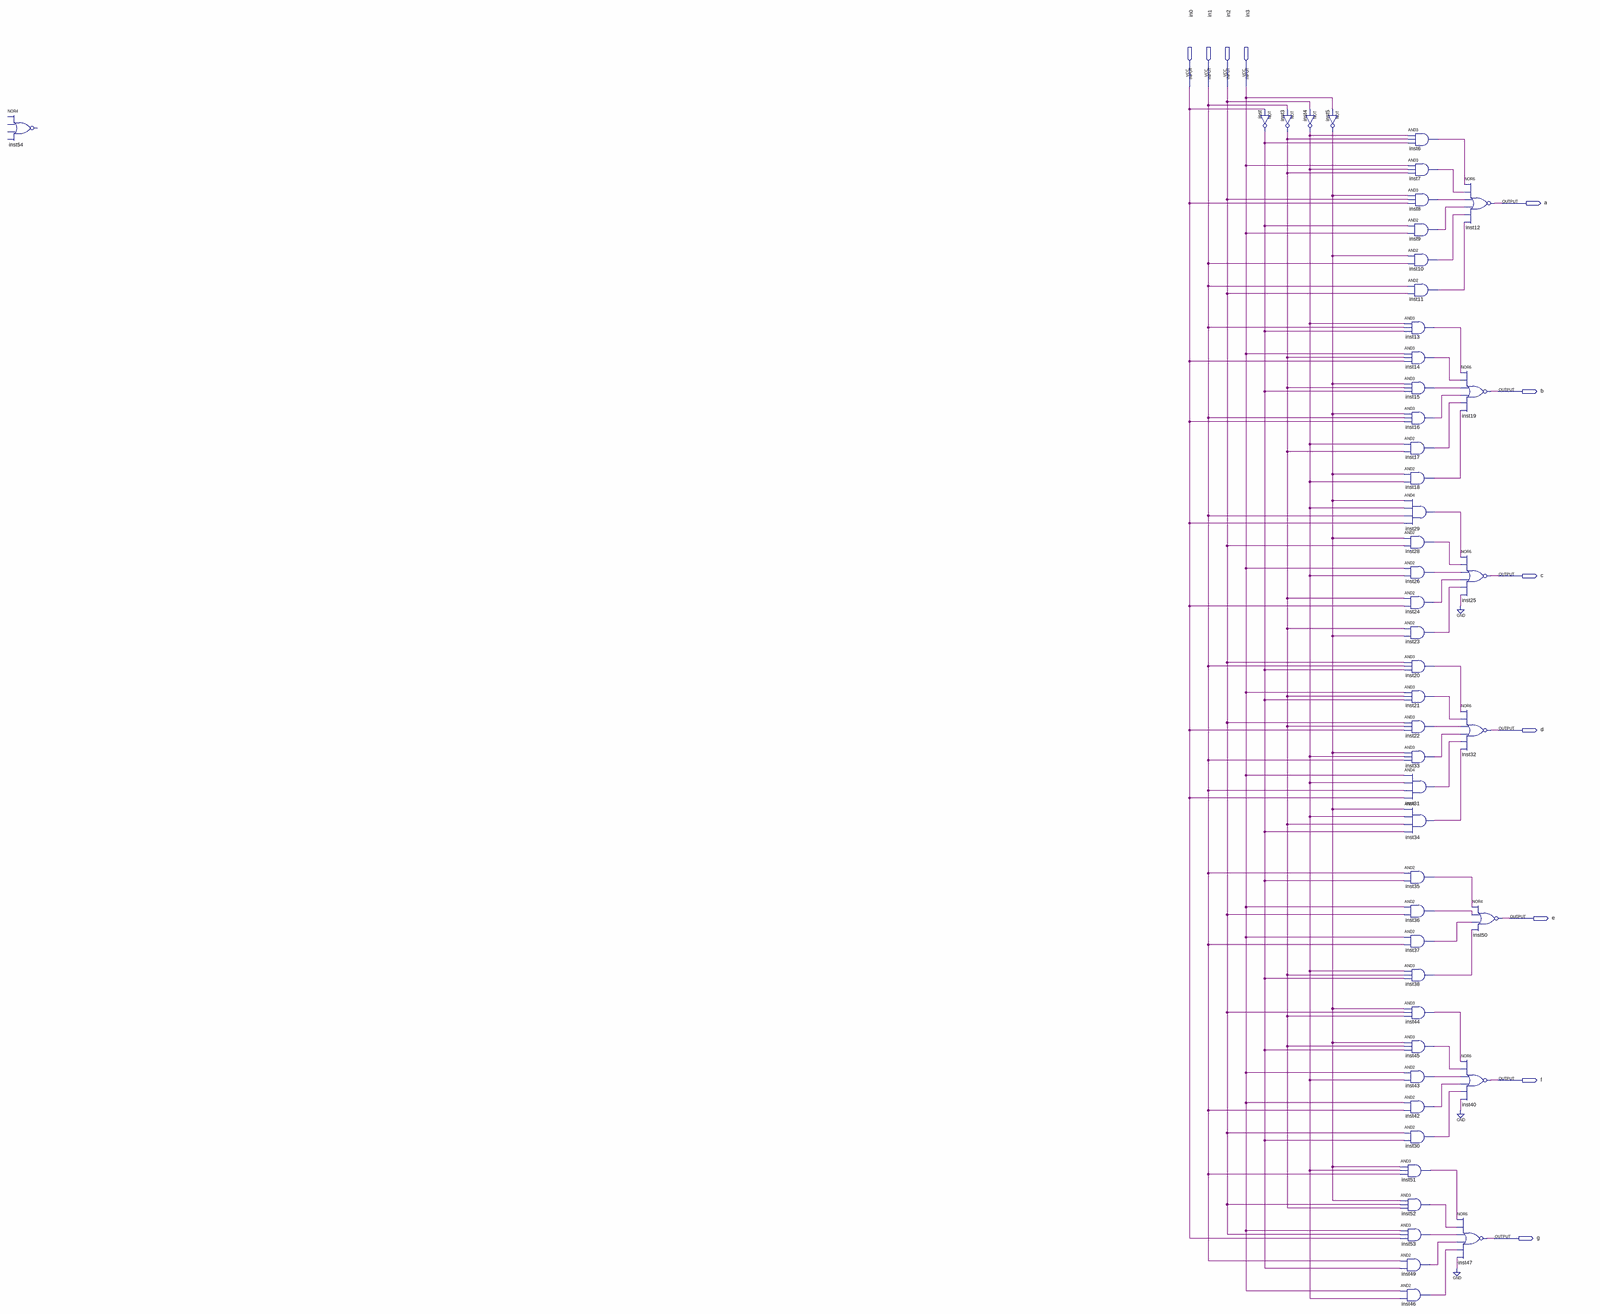
[diagram p0: schematic sheet, whole]
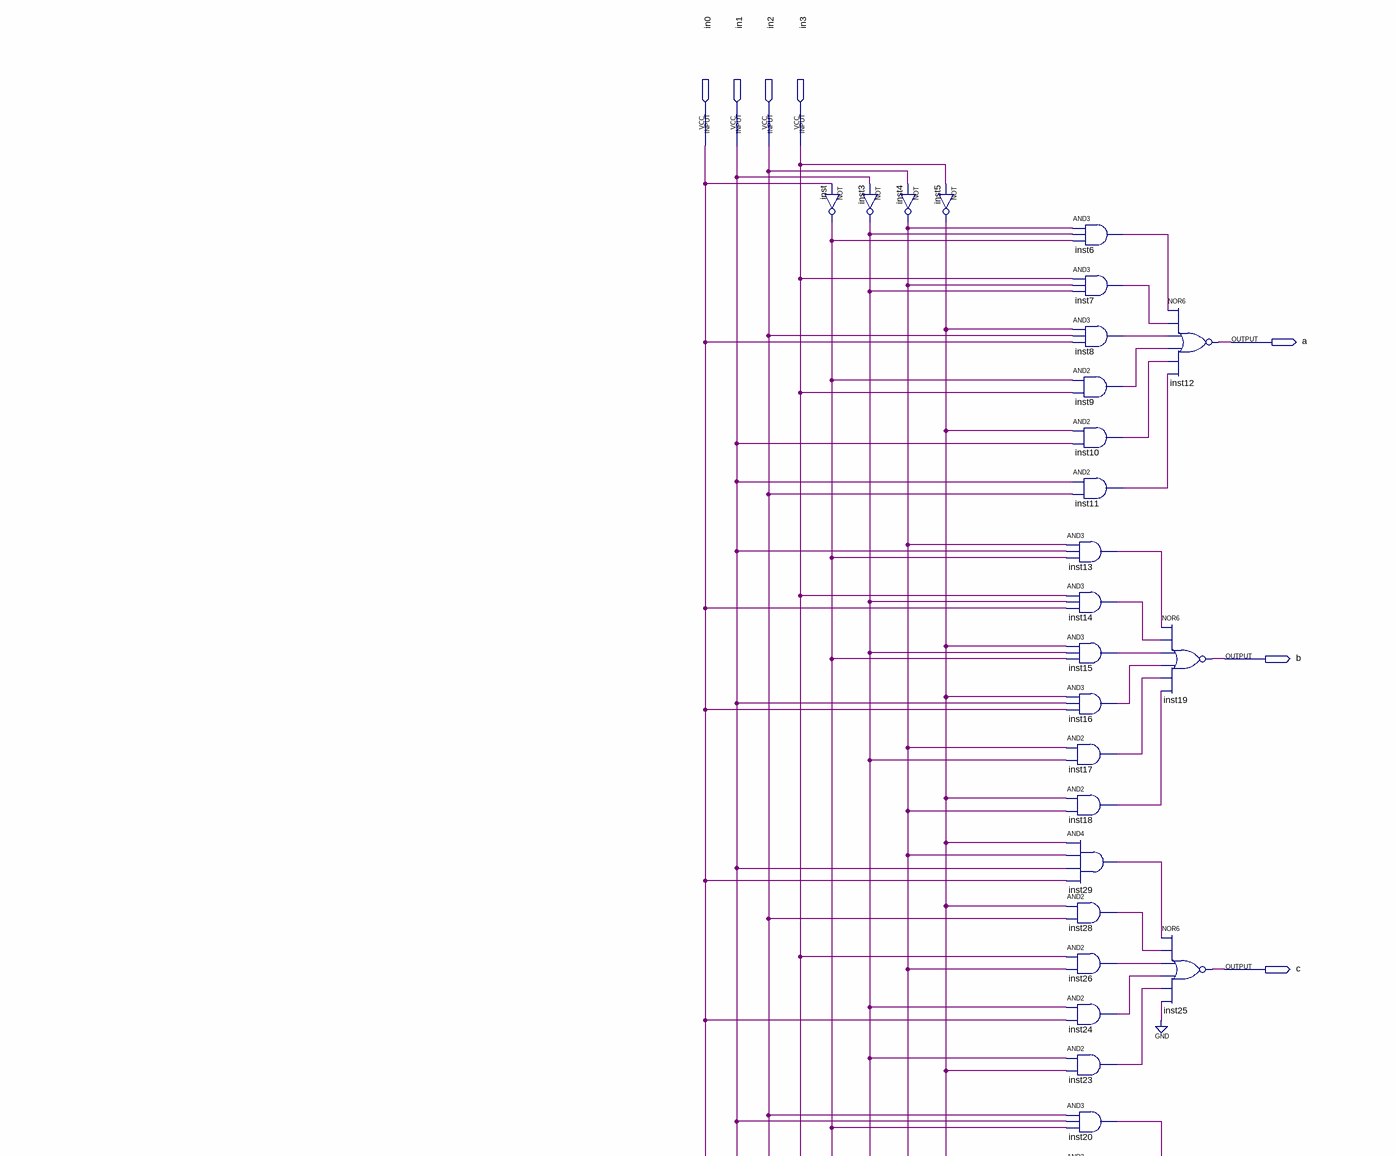
[diagram p1: schematic sheet, upper right part]
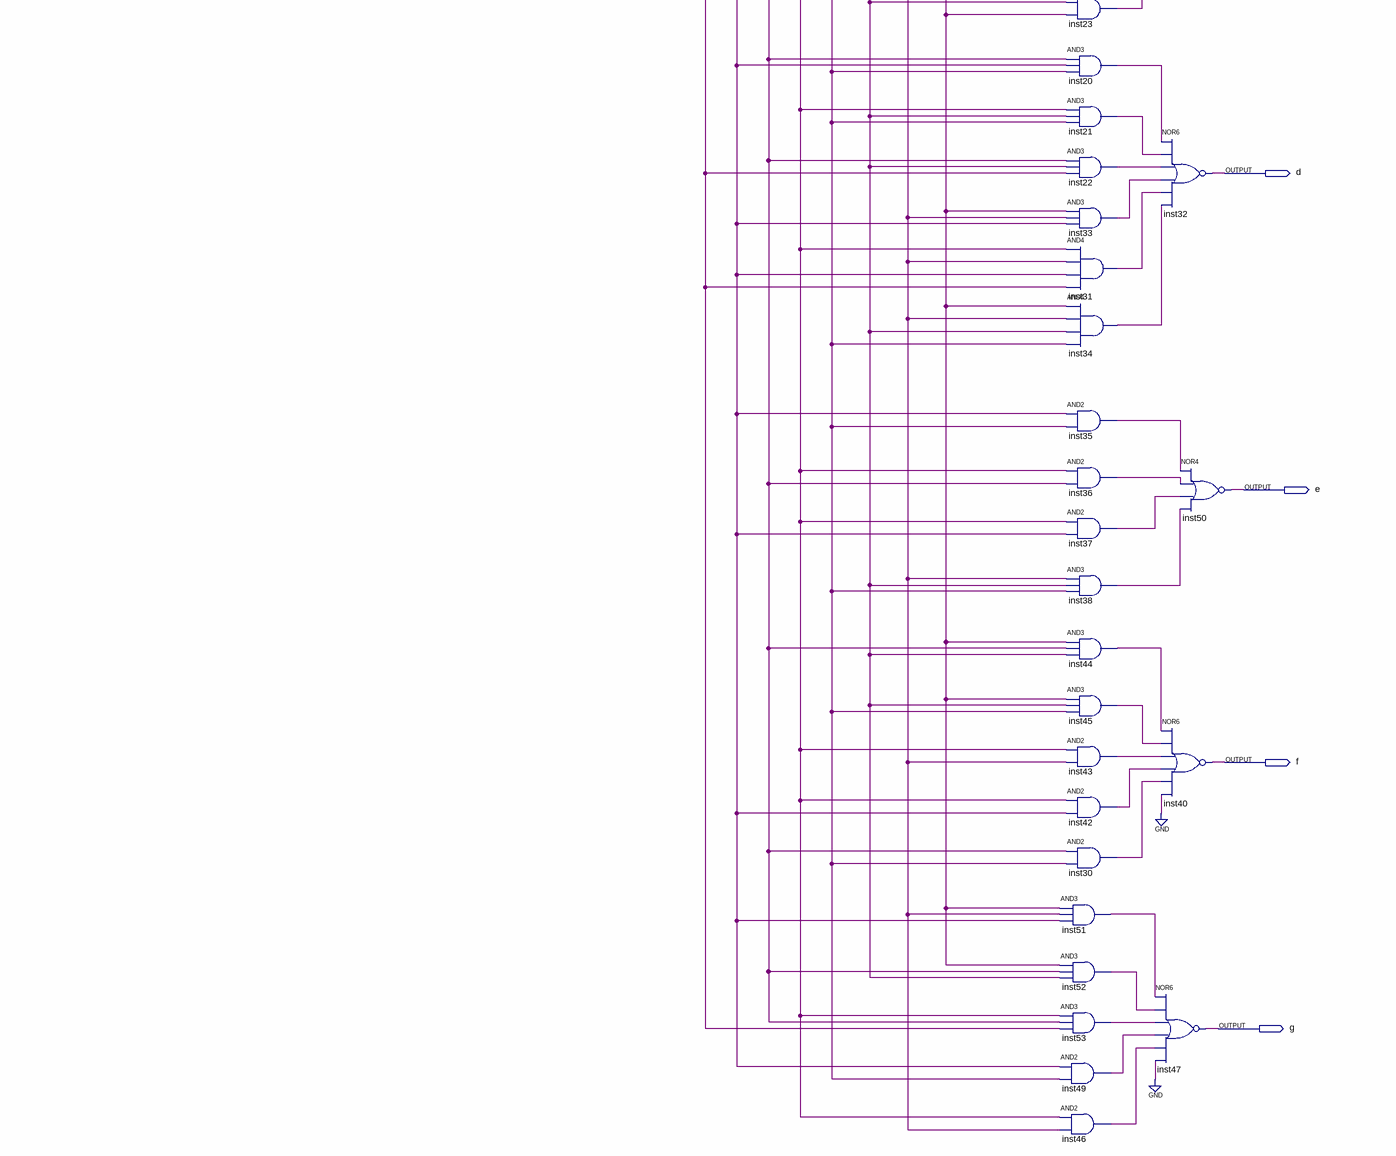
[diagram p2: schematic sheet, lower right part]
// Quartus schematic lab4.bdf as structural Verilog: 49 symbols, 11 pins
module lab4 (
  input  in0,
  input  in1,
  input  in2,
  input  in3,
  output a,
  output b,
  output c,
  output d,
  output e,
  output f,
  output g
);

  wire inst3_out, inst4_out, inst5_out, inst6_out, inst7_out, inst8_out, inst9_out, inst10_out, inst11_out,
       inst13_out, inst14_out, inst15_out, inst16_out, inst17_out, inst18_out, inst20_out, inst21_out,
       inst22_out, inst23_out, inst24_out, inst26_out, inst28_out, inst29_out, inst30_out, inst31_out,
       inst33_out, inst34_out, inst35_out, inst36_out, inst37_out, inst38_out, inst42_out, inst43_out,
       inst44_out, inst45_out, inst46_out, inst49_out, inst51_out, inst52_out, inst53_out, inst_out;

  // NOR4 inst54 is placed but not wired
  not inst (inst_out, in0);
  not inst3 (inst3_out, in1);
  not inst4 (inst4_out, in2);
  not inst5 (inst5_out, in3);
  and inst6 (inst6_out, inst4_out, inst3_out, inst_out);
  and inst7 (inst7_out, in3, inst4_out, inst3_out);
  and inst8 (inst8_out, inst5_out, in2, in0);
  and inst9 (inst9_out, inst_out, in3);
  and inst10 (inst10_out, inst5_out, in1);
  and inst11 (inst11_out, in1, in2);
  and inst13 (inst13_out, inst4_out, in1, inst_out);
  and inst14 (inst14_out, in3, inst3_out, in0);
  and inst15 (inst15_out, inst5_out, inst3_out, inst_out);
  and inst16 (inst16_out, inst5_out, in1, in0);
  and inst17 (inst17_out, inst4_out, inst3_out);
  and inst18 (inst18_out, inst5_out, inst4_out);
  and inst29 (inst29_out, inst5_out, inst4_out, in1, in0);
  and inst28 (inst28_out, inst5_out, in2);
  and inst26 (inst26_out, in3, inst4_out);
  and inst24 (inst24_out, inst3_out, in0);
  and inst23 (inst23_out, inst3_out, inst5_out);
  and inst20 (inst20_out, in2, in1, inst_out);
  and inst21 (inst21_out, in3, inst3_out, inst_out);
  and inst22 (inst22_out, in2, inst3_out, in0);
  and inst33 (inst33_out, inst5_out, inst4_out, in1);
  and inst31 (inst31_out, in3, inst4_out, in1, in0);
  and inst34 (inst34_out, inst5_out, inst4_out, inst3_out, inst_out);
  and inst35 (inst35_out, in1, inst_out);
  and inst36 (inst36_out, in3, in2);
  and inst37 (inst37_out, in3, in1);
  and inst38 (inst38_out, inst4_out, inst3_out, inst_out);
  and inst44 (inst44_out, inst5_out, in2, inst3_out);
  and inst45 (inst45_out, inst5_out, inst3_out, inst_out);
  and inst43 (inst43_out, in3, inst4_out);
  and inst42 (inst42_out, in3, in1);
  and inst30 (inst30_out, in2, inst_out);
  and inst51 (inst51_out, inst5_out, inst4_out, in1);
  and inst52 (inst52_out, inst5_out, in2, inst3_out);
  and inst53 (inst53_out, in3, in2, in0);
  and inst49 (inst49_out, in1, inst_out);
  and inst46 (inst46_out, in3, inst4_out);
  nor inst12 (a, inst6_out, inst7_out, inst8_out, inst9_out, inst10_out, inst11_out);
  nor inst19 (b, inst13_out, inst14_out, inst15_out, inst16_out, inst17_out, inst18_out);
  nor inst25 (c, inst29_out, inst28_out, inst26_out, inst24_out, inst23_out, 1'b0);
  nor inst32 (d, inst20_out, inst21_out, inst22_out, inst33_out, inst31_out, inst34_out);
  nor inst40 (f, inst44_out, inst45_out, inst43_out, inst42_out, inst30_out, 1'b0);
  nor inst47 (g, inst51_out, inst52_out, inst53_out, inst49_out, inst46_out, 1'b0);
  nor inst50 (e, inst35_out, inst36_out, inst37_out, inst38_out);
endmodule
